# EAGLE schematic MegaShieldTrio (EAGLE 6.5.0)
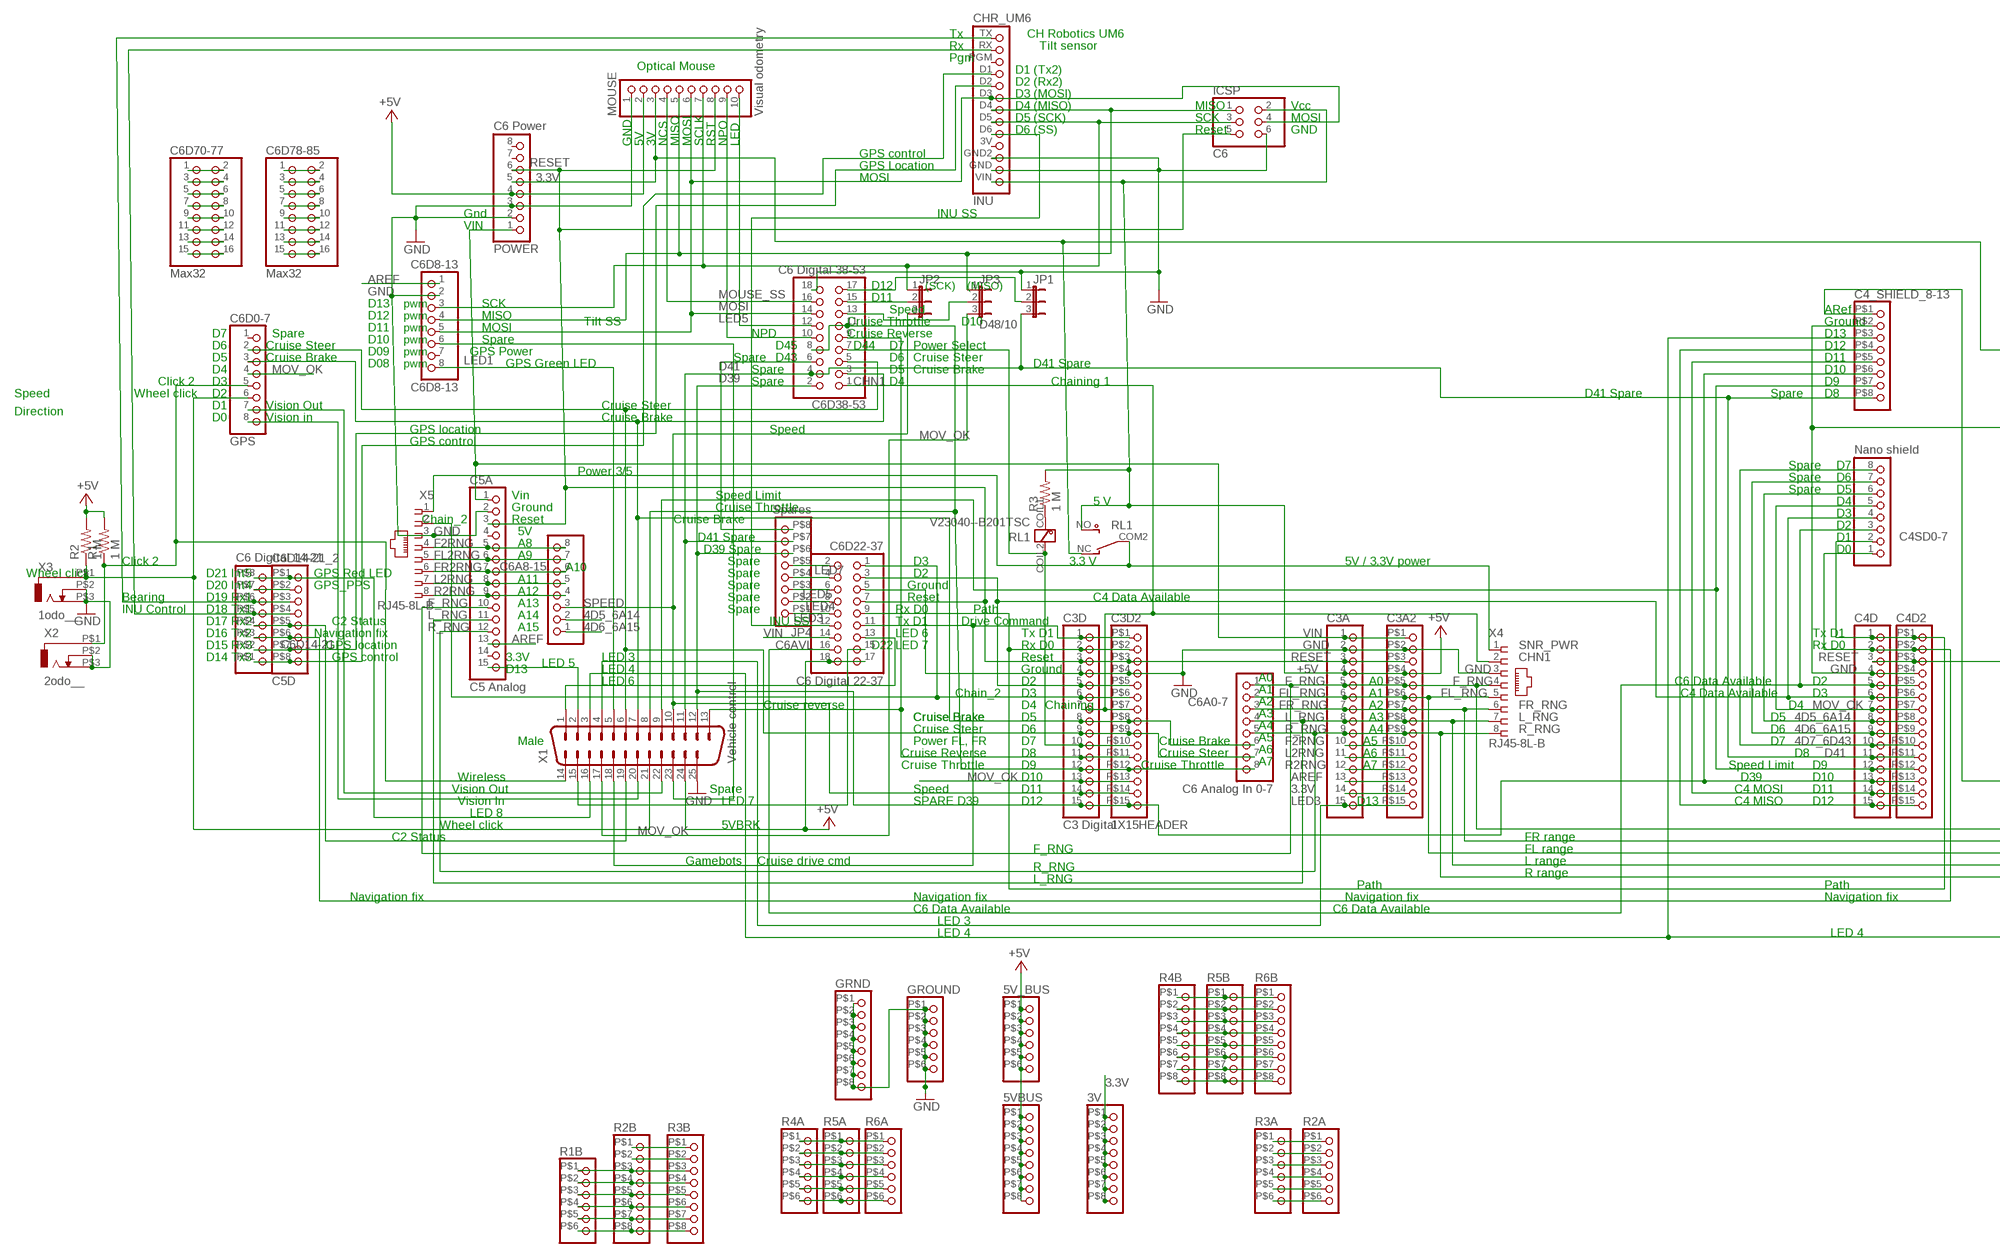
[diagram p0: schematic, sheet 1, part 1 of 2]
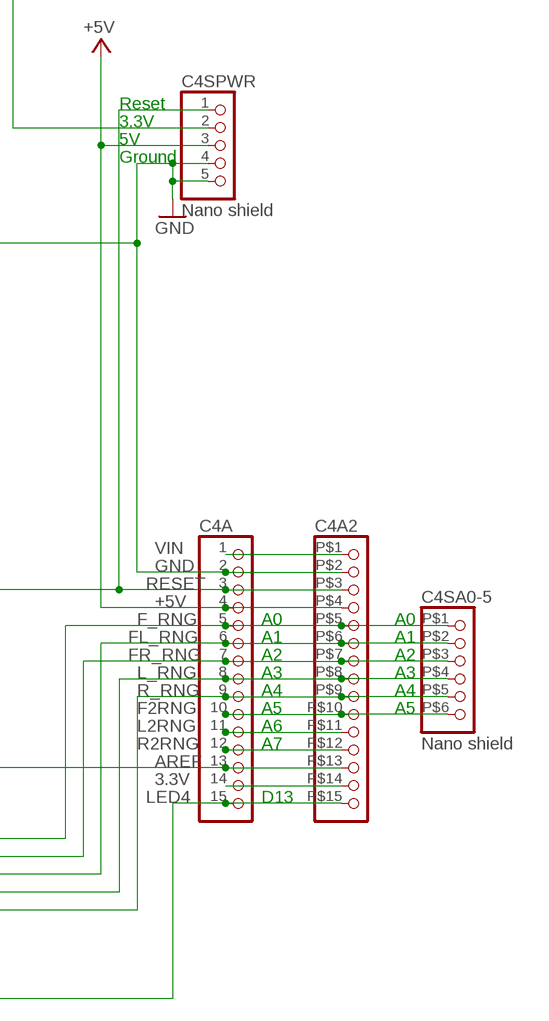
[diagram p1: schematic, sheet 1, part 2 of 2]

## Parts
3V  PINHD-1X8SMALL8  [1X8HEADER]
5V_BUS  1X6HEADER  [1X6HEADER]
5VBUS  PINHD-1X8SMALL8  [1X8HEADER]
C3A  PINHD-1X15  [1X15]
C3A2  1X15HEADER  [1X15HEADER]
C3D  C3 Digital  PINHD-1X15  [1X15]
C3D2  1X15HEADER  [1X15HEADER]
C4_SHIELD_8-13  PINHD-1X8SMALL8  [1X8HEADER]
C4A  PINHD-1X15  [1X15]
C4A2  1X15HEADER  [1X15HEADER]
C4D  PINHD-1X15  [1X15]
C4D2  1X15HEADER  [1X15HEADER]
C4SA0-5  Nano shield  1X6HEADER  [1X6HEADER]
C4SD0-7  Nano shield  PINHD-1X8  [1X08]
C4SPWR  Nano shield  PINHD-1X5  [1X05]
C5A  C5 Analog  PINHD-1X15  [1X15]
C6A0-7  C6 Analog In 0-7  PINHD-1X8  [1X08]
C6A8-15  PINHD-1X8  [1X08]
C6D0-7  GPS  PINHD-1X8  [1X08]
C6D8-13  C6D8-13  PINHD-1X8  [1X08]
C6D14-21  C6 Digital 14-21  PINHD-1X8SMALL8  [1X8HEADER]
C6D14-21_2  C5D  PINHD-1X8SMALL8  [1X8HEADER]
C6D22-37  C6 Digital 22-37  PINHD-2X9  [2X09]
C6D38-53  C6 Digital 38-53  PINHD-2X9  [2X09]
C6D70-77  Max32  PINHD-2X8  [2X08]
C6D78-85  Max32  PINHD-2X8  [2X08]
GRND  PINHD-1X8SMALL8  [1X8HEADER]
GROUND  1X6HEADER  [1X6HEADER]
ICSP  C6  PINHD-2X3  [2X03]
INU  CHR_UM6  [CHR_UM6]
JP1  JP2E  [JP2]
JP2  JP2E  [JP2]
JP3  D48/10  JP2E  [JP2]
JP4  Spares  PINHD-1X8SMALL8  [1X8HEADER]
MOUSE  Visual odometry  PINHD-1X10  [1X10]
POWER  C6 Power  PINHD-1X8  [1X08]
R1  1 M  R-US_0207/10  [0207/10]
R1B  1X6HEADER  [1X6HEADER]
R2  1 M  R-US_0207/10  [0207/10]
R2A  1X6HEADER  [1X6HEADER]
R2B  PINHD-1X8SMALL8  [1X8HEADER]
R3  1 M  R-US_0207/10  [0207/10]
R3A  1X6HEADER  [1X6HEADER]
R3B  PINHD-1X8SMALL8  [1X8HEADER]
R4A  1X6HEADER  [1X6HEADER]
R4B  PINHD-1X8SMALL8  [1X8HEADER]
R5A  1X6HEADER  [1X6HEADER]
R5B  PINHD-1X8SMALL8  [1X8HEADER]
R6A  1X6HEADER  [1X6HEADER]
R6B  PINHD-1X8SMALL8  [1X8HEADER]
RL1  V23040--B201TSC  [TSC-112L3H]
X1  Vehicle control  M25H  [M25H]
X2  2odo__  ODO_JACK  [ODO_JACK]
X3  1odo__  ODO_JACK  [ODO_JACK]
X4  RJ45-8L-B  [RJ45-NO-SHIELD]
X5  RJ45-8L-B  [RJ45-NO-SHIELD]

## Nets
3.3V: 3V.P$1 3V.P$2 3V.P$3 3V.P$4 3V.P$5 3V.P$6 3V.P$7 3V.P$8 C3A2.P$14 C3A.14 C4A2.P$14 C4A.14 C4SPWR.2 MOUSE.3 POWER.5 RL1.NC
4D5_6A14: C4D2.P$8 C4D.8 C4SD0-7.6 C6A8-15.2
4D6_6A15: C4D2.P$9 C4D.9 C4SD0-7.7 C6A8-15.1
4D7_6D43: C4D2.P$10 C4D.10 C4SD0-7.8
6D10_2A6: C6D8-13.6 X1.23
+5V: 5V_BUS.P$1 5V_BUS.P$2 5V_BUS.P$3 5V_BUS.P$4 5V_BUS.P$5 5V_BUS.P$6 5VBUS.P$1 5VBUS.P$2 5VBUS.P$3 5VBUS.P$4 5VBUS.P$5 5VBUS.P$6 5VBUS.P$7 5VBUS.P$8 C3A2.P$4 C3A.4 C4A2.P$4 C4A.4 C4SPWR.3 C6D22-37.17 C6D22-37.18 ICSP.2 INU.VIN MOUSE.2 POWER.4 R1.2 R2.2 R3.2 RL1.NO X1.24
AREF: C3A2.P$13 C3A.13 C4_SHIELD_8-13.P$1 C4A2.P$13 C4A.13 C5A.13 C6D8-13.1
C2STAT: C6D14-21.P$4 C6D14-21_2.P$5 X1.19
C4AVL: C3D2.P$5 C3D.5 C4D2.P$6 C4D.6 C4SD0-7.4 C6D22-37.3
C4D11: C4_SHIELD_8-13.P$5 C4D2.P$14 C4D.14
C4D12: C4_SHIELD_8-13.P$4 C4D2.P$15 C4D.15
C6AVL: C4D2.P$5 C4D.5 C4SD0-7.3 C6D22-37.16
C6D29: C6D22-37.10 JP4.P$1
C6D31: C6D22-37.8 JP4.P$2
C6D33: C6D22-37.6 JP4.P$3
C6D35: C6D22-37.4 JP4.P$4
C6D37: C6D22-37.2 JP4.P$5
CHN1: C3D2.P$7 C3D.7 C6D38-53.1 X4.2
CHN2: C3D2.P$6 C3D.6 C6D22-37.1 X5.2
CLICK1: C6D0-7.6 R2.1 X1.21 X3.P$1
CLICK2: C6D0-7.5 R1.1 X1.14 X2.P$1
CRS_BRK: C3D2.P$8 C3D.8 C6A0-7.6 C6D0-7.3 C6D38-53.3 X1.7
CRS_REV: C3D2.P$11 C3D.11 C6D38-53.9 X1.13
CRS_STR: C3D2.P$9 C3D.9 C6A0-7.7 C6D0-7.2 C6D38-53.5 X1.6
CRS_THR: C3D2.P$12 C3D.12 C6A0-7.8 C6D38-53.8 C6D38-53.11 X1.8
D39: C3D2.P$15 C3D.15 C4_SHIELD_8-13.P$6 C4D2.P$13 C4D.13 C6D38-53.2 JP4.P$6 X1.12
D41: C4_SHIELD_8-13.P$8 C4D2.P$11 C4D.11 C6D38-53.4 JP1.3 JP4.P$7 X1.11
DRV_CMD: C3D2.P$1 C3D.1 C6D22-37.11 X1.18
F2RNG: C3A2.P$10 C3A.10 C4A2.P$10 C4A.10 C4SA0-5.P$6 C5A.5 C6A8-15.8 X5.4
F_RNG: C3A2.P$5 C3A.5 C4A2.P$5 C4A.5 C4SA0-5.P$1 C5A.10 C6A0-7.1 X4.4
FL2RNG: C5A.6 C6A8-15.7 X5.5
FL_RNG: C3A2.P$6 C3A.6 C4A2.P$6 C4A.6 C4SA0-5.P$2 C6A0-7.2 X4.5
FR2RNG: C5A.7 C6A8-15.6 X5.6
FR_RNG: C3A2.P$7 C3A.7 C4A2.P$7 C4A.7 C4SA0-5.P$3 C6A0-7.3 X4.6
GND: C3A2.P$2 C3A.2 C3D2.P$4 C3D.4 C4_SHIELD_8-13.P$2 C4A2.P$2 C4A.2 C4D2.P$4 C4D.4 C4SPWR.4 C4SPWR.5 C5A.2 C6D8-13.2 C6D22-37.5 C6D38-53.18 GRND.P$1 GRND.P$2 GRND.P$3 GRND.P$4 GRND.P$5 GRND.P$6 GRND.P$7 GRND.P$8 GROUND.P$1 GROUND.P$2 GROUND.P$3 GROUND.P$4 GROUND.P$5 GROUND.P$6 ICSP.6 INU.GND INU.GND2 JP1.1 MOUSE.1 POWER.2 POWER.3 X1.25 X2.P$2 X2.P$3 X3.P$2 X3.P$3 X4.3 X5.3
GPS_CNTRL: C6D14-21.P$1 C6D14-21_2.P$8 INU.D1
GPS_LOC: C6D14-21.P$2 C6D14-21_2.P$7 INU.D2
INU_BRN: C6D14-21.P$6 C6D14-21_2.P$3 INU.TX
INU_CNTRL: C6D14-21.P$5 C6D14-21_2.P$4 INU.RX
INU_SS: C6D22-37.12 INU.D6
L2RNG: C3A2.P$11 C3A.11 C4A2.P$11 C4A.11 C5A.8 C6A8-15.5 X5.7
L_RNG: C3A2.P$8 C3A.8 C4A2.P$8 C4A.8 C4SA0-5.P$4 C5A.11 C6A0-7.4 X4.7
LED1: C6D8-13.8 X1.5
LED3: C3A2.P$15 C3A.15 X1.4
LED4: C4_SHIELD_8-13.P$3 C4A2.P$15 C4A.15 X1.3
LED5: C5A.15 C6D38-53.12 MOUSE.10 X1.2
LED6: C6D22-37.13 X1.1
LED7: C6D22-37.15 X1.15
LED8: C6D14-21.P$8 C6D14-21_2.P$1 X1.16
MISO: C6D8-13.4 ICSP.1 INU.D4 JP3.1 MOUSE.5
MOSI: C6D8-13.5 C6D38-53.14 ICSP.4 INU.D3 MOUSE.6
MOUSE_SS: C6D38-53.16 MOUSE.4
MOV_OK: C3D2.P$13 C3D.13 C4D2.P$7 C4D.7 C4SD0-7.5 C6D0-7.4 JP3.3 X1.17
N$1: R2B.P$1 R3B.P$1
N$2: R2B.P$2 R3B.P$2
N$3: C6D38-53.6 JP4.P$8
N$4: C6D38-53.15 JP2.2
N$5: C6D38-53.13 JP3.2
N$6: C6D38-53.17 JP1.2
N$7: C6D14-21.P$7 C6D14-21_2.P$2
N$8: R3.1 RL1.COIL1
N$10: R1B.P$1 R2B.P$3 R3B.P$3
N$11: R1B.P$2 R2B.P$4 R3B.P$4
N$12: R1B.P$3 R2B.P$5 R3B.P$5
N$13: R1B.P$4 R2B.P$6 R3B.P$6
N$14: R1B.P$5 R2B.P$7 R3B.P$7
N$15: R1B.P$6 R2B.P$8 R3B.P$8
N$16: R4A.P$1 R5A.P$1 R6A.P$1
N$17: R4A.P$2 R5A.P$2 R6A.P$2
N$18: R4A.P$3 R5A.P$3 R6A.P$3
N$19: R4A.P$4 R5A.P$4 R6A.P$4
N$20: R4A.P$5 R5A.P$5 R6A.P$5
N$21: R4A.P$6 R5A.P$6 R6A.P$6
N$22: R4B.P$1 R5B.P$1 R6B.P$1
N$23: C6D78-85.1 C6D78-85.2
N$24: C6D78-85.3 C6D78-85.4
N$25: R4B.P$2 R5B.P$2 R6B.P$2
N$26: R4B.P$3 R5B.P$3 R6B.P$3
N$28: C6D78-85.5 C6D78-85.6
N$29: R4B.P$5 R5B.P$5 R6B.P$5
N$30: C6D78-85.7 C6D78-85.8
N$31: C6D78-85.9 C6D78-85.10
N$32: R4B.P$6 R5B.P$6 R6B.P$6
N$33: R4B.P$7 R5B.P$7 R6B.P$7
N$34: R4B.P$8 R5B.P$8 R6B.P$8
N$35: R2A.P$1 R3A.P$1
N$36: R2A.P$2 R3A.P$2
N$37: C6D78-85.11 C6D78-85.12
N$38: C6D78-85.13 C6D78-85.14
N$39: C6D78-85.15 C6D78-85.16
N$40: R2A.P$3 R3A.P$3
N$41: C6D70-77.1 C6D70-77.2
N$42: R2A.P$4 R3A.P$4
N$43: R2A.P$5 R3A.P$5
N$44: C6D70-77.3 C6D70-77.4
N$45: C6D70-77.5 C6D70-77.6
N$46: C6D70-77.7 C6D70-77.8
N$47: C6D70-77.9 C6D70-77.10
N$48: C6D70-77.11 C6D70-77.12
N$49: C6D70-77.13 C6D70-77.14
N$50: C6D70-77.15 C6D70-77.16
N$51: R2A.P$6 R3A.P$6
NAV_FIX: C4D2.P$2 C4D.2 C4SD0-7.1 C6D14-21.P$3 C6D14-21_2.P$6
NPD: C6D38-53.10 MOUSE.9
PATH: C3D2.P$2 C3D.2 C4D2.P$1 C4D.1 C4SD0-7.2 C6D22-37.9
PWR_SEL: C3D2.P$10 C3D.10 C6D38-53.7 RL1.COIL2
R2RNG: C3A2.P$12 C3A.12 C4A2.P$12 C4A.12 C5A.9 C6A8-15.4 X5.8
R5B: R4B.P$4 R5B.P$4 R6B.P$4
R_RNG: C3A2.P$9 C3A.9 C4A2.P$9 C4A.9 C4SA0-5.P$5 C5A.12 C6A0-7.5 X4.8
RESET: C3A2.P$3 C3A.3 C3D2.P$3 C3D.3 C4A2.P$3 C4A.3 C4D2.P$3 C4D.3 C4SPWR.1 C5A.3 C6D22-37.7 ICSP.5 MOUSE.8 POWER.6
SCK: C6D8-13.3 ICSP.3 INU.D5 JP2.1 MOUSE.7
SNR_PWR: RL1.COM2 X4.1 X5.1
SPD_LMT: C4_SHIELD_8-13.P$7 C4D2.P$12 C4D.12 X1.9
SPEED: C3D2.P$14 C3D.14 C6A8-15.3 JP2.3 X1.10
VIN: C3A2.P$1 C3A.1 C4A2.P$1 C4A.1 C5A.1 C6D22-37.14 POWER.1
VIS_IN: C6D0-7.8 X1.20
VIS_OUT: C6D0-7.7 X1.22
Unconnected: C5A.4 C5A.14 C6D0-7.1 C6D8-13.7 INU.3V INU.PGM POWER.7 POWER.8 RL1.COM1

## Notes on the sheet
- Tx | CH Robotics UM6
- Rx | Tilt sensor
- Optical Mouse | Pgm
- D1 (Tx2)
- D2 (Rx2)
- D3 (MOSI)
- D4 (MISO) | MISO | Vcc
- D5 (SCK) | SCK | MOSI
- D6 (SS) | Reset | GND
- GND | 5V | 3V | NCS | MISO | MOSI | SCLK | RST | NPO | LED
- GPS control
- GPS Location
- MOSI
- Gnd | INU SS
- VIN
- D12 | (SCK) | (MISO)
- D11
- D13 | pwm | SCK
- Speed | ARef
- D12 | pwm | MISO
- Tilt SS | Cruise Throttle | D10 | Ground
- D11 | pwm | MOSI
- D7 | Spare | NPD | Cruise Reverse | D13 | Reset
- D10 | pwm | Spare
- D6 | Cruise Steer | D45 | D44 | D7 | Power Select | D12 | 3.3V
- D09 | pwm | GPS Power
- D5 | Cruise Brake | Spare | D43 | D6 | Cruise Steer | D11 | 5V
- D08 | pwm | GPS Green LED | D41 Spare
- D4 | Spare | D5 | Cruise Brake | D10 | Ground
- Click 2 | D3 | Spare | D4 | Chaining 1 | D9
- Speed | Wheel click | D2 | D41 Spare | Spare | D8
- D1 | Vision Out | Cruise Steer
- Direction
- D0 | Vision in | Cruise Brake
- GPS location | Speed
- GPS control
- Spare | D7
- Power 3/5
- Spare | D6
- Spare | D5
- Vin | Speed Limit
- 5 V | D4
- Ground | Cruise Throttle
- D3
- Chain_2 | Reset | Cruise Brake
- D2
- 5V
- D41 Spare | D1
- A8
- D39 Spare | D0
- A9
- Click 2 | Spare | D3 | 3.3 V | 5V / 3.3V power
- A10
- Wheel click | D21 Int5 | GPS Red LED | Spare | D2
- A11
- D20 Int4 | GPS_PPS | Spare | Ground
- A12
- Bearing | D19 Rx1 | Spare | Reset | C4 Data Available
- A13
- INU Control | D18 Tx1 | Spare | Rx D0 | Path
- A14
- D17 Rx2 | C2 Status | INU SS | Tx D1 | Drive Command
- A15
- D16 Tx2 | Navigation fix | LED 6 | Tx D1 | Tx D1
- D15 Rx3 | GPS location | D22 | LED 7 | Rx D0 | Rx D0
- D14 Tx3 | GPS control | 3.3V | LED 3 | Reset
- LED 5
- D13 | LED 4 | Ground | A0
- LED 6 | D2 | A1 | A0 | C6 Data Available | D2 | A0 | A0
- Chain_2 | D3 | A2 | A1 | C4 Data Available | D3 | A1 | A1
- Cruise reverse | D4 | Chaining | A3 | A2 | D4 | A2 | A2
- Cruise Brake | Cruise Brake | D5 | A4 | A3 | D5 | A3 | A3
- Cruise Steer | D6 | A5 | A4 | D6 | A4 | A4
- Male | Power FL, FR | D7 | Cruise Brake | A6 | A5 | D7 | A5 | A5
- Cruise Reverse | D8 | Cruise Steer | A7 | A6 | D8 | A6
- Cruise Throttle | D9 | Cruise Throttle | A7 | Speed Limit | D9 | A7
- Wireless | D10 | D39 | D10
- Vision Out | Spare | Speed | D11 | C4 MOSI | D11
- Vision In | LED 7 | SPARE D39 | D12 | D13 | C4 MISO | D12 | D13
- LED 8
- Wheel click | 5VBRK
- C2 Status | FR range
- F_RNG | FL range
- Gamebots | Cruise drive cmd | L range
- R_RNG
- R range
- L_RNG
- Path | Path
- Navigation fix | Navigation fix | Navigation fix | Navigation fix
- C6 Data Available | C6 Data Available
- LED 3
- LED 4 | LED 4

## Library data of the parts
3V 5VBUS C4_SHIELD_8-13 C6D14-21 C6D14-21_2 GRND JP4 R2B R3B R4B R5B R6B = Elcano:PINHD-1X8: PIN HEADER
5V_BUS C4SA0-5 GROUND R1B R2A R3A R4A R5A R6A = Elcano:1X6HEADER
C3A C3D C4A C4D C5A = pinhead:PINHD-1X15: PIN HEADER
C3A2 C3D2 C4A2 C4D2 = Elcano:1X15HEADER
C4SD0-7 C6A0-7 C6A8-15 C6D0-7 C6D8-13 POWER = pinhead:PINHD-1X8: PIN HEADER
C4SPWR = pinhead:PINHD-1X5: PIN HEADER
C6D22-37 C6D38-53 = pinhead:PINHD-2X9: PIN HEADER
C6D70-77 C6D78-85 = pinhead:PINHD-2X8: PIN HEADER
ICSP = pinhead:PINHD-2X3: PIN HEADER
INU = Elcano:CHR_UM6: Tilt sensor
JP1-JP3 = jumper:JP2E: JUMPER
MOUSE = pinhead:PINHD-1X10: PIN HEADER
R1-R3 = rcl:R-US_: RESISTOR, American symbol
RL1 = Elcano:V23040-*-B201: SIEMENS Monostabil A0001 = 5V; A0002 = 12V; A0003 = 15V; A0004 = 24V Bistabil C0051 = 5V; C0052 = 12V
X1 = con-subd:M25: SUB-D; OC_FARNELL: unknown; OC_NEWARK: unknown
X2 X3 = Elcano:ODO_JACK
X4 X5 = con-tycoelectronics:RJ45: CORCOM Modular RJ Jacks No Shield Source: www.tycoelectronics.com .. ENG_DS_1654001_1099_RJ_L_0507.pdf; MF: TYCO ELECTRONICS; MPN: RJ45-8L-B; OC_FARNELL: 1279843; OC_NEWARK: 52K4445

## Net classes
0 default: width 0.152 mm, drill 0.305 mm, clearance 0.152 mm